# Altium project CC2640R2F_Bluetooth_Beacon.PrjPCB
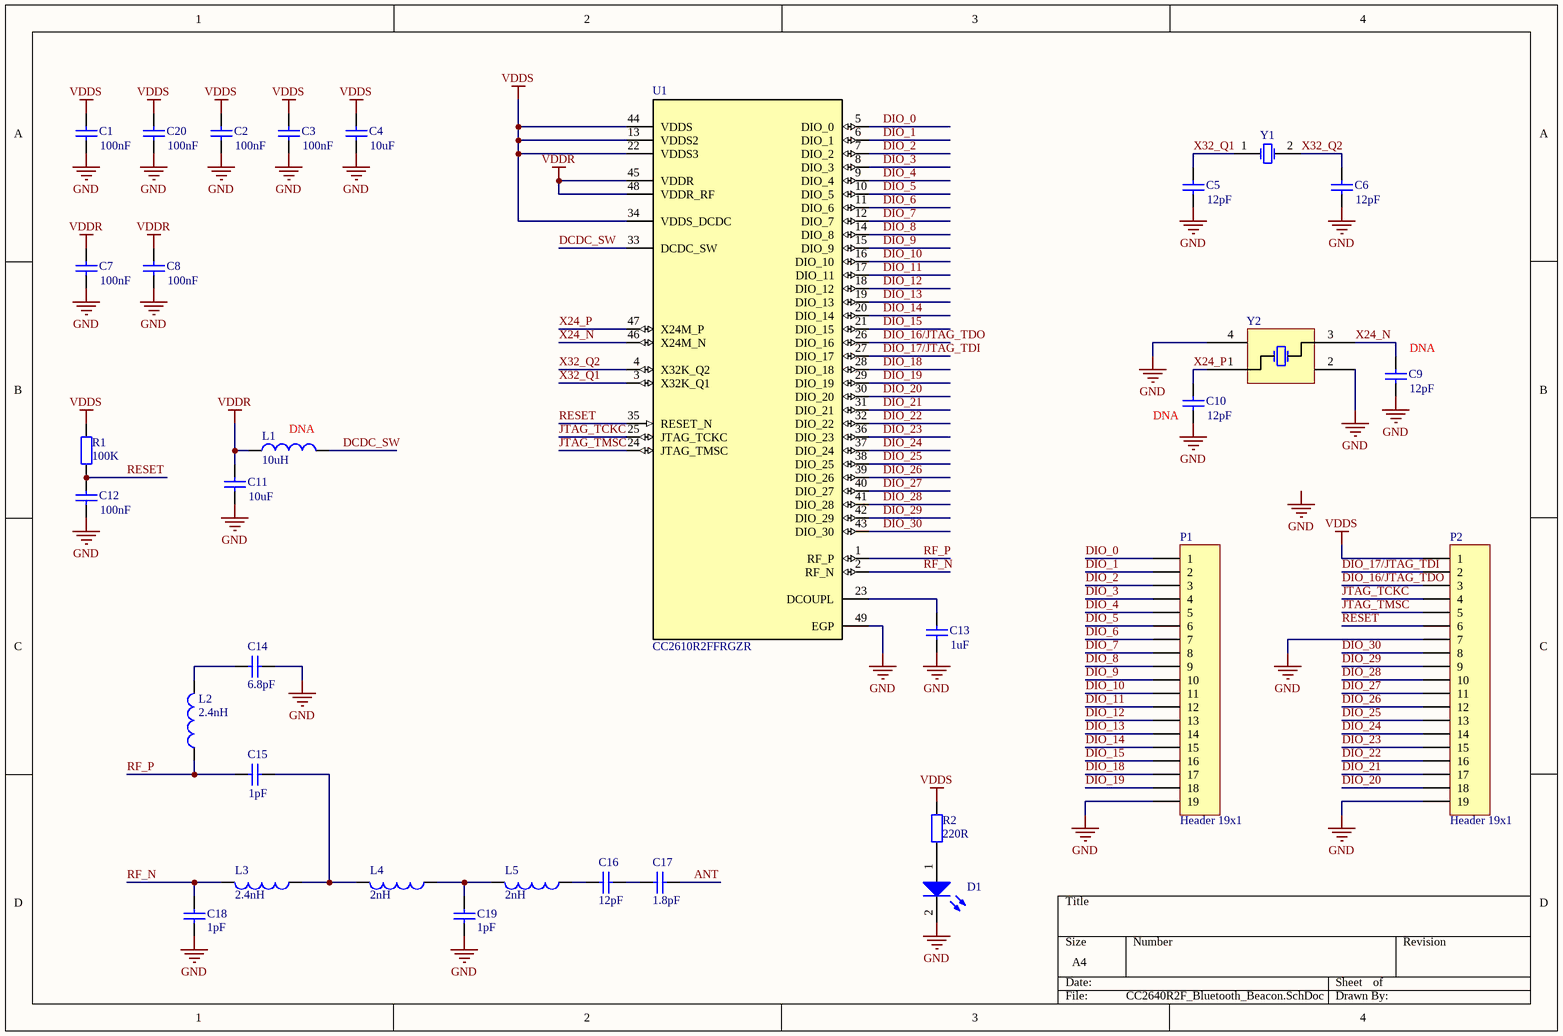
[diagram p0: CC2640R2F_Bluetooth_Beacon.SchDoc]
1 sheet, 33 parts. Net scope: global (net labels, ports and power ports of the same name join across sheets).
Board file: CC2640R2F_Bluetooth_Beacon.PcbDoc

## Sheet CC2640R2F_Bluetooth_Beacon.SchDoc
size A4

### Parts
C1  value 100nF  [0603]  (hidden comment: Cap)
C2  value 100nF  [0603]  (hidden comment: Cap)
C3  value 100nF  [0603]  (hidden comment: Cap)
C4  value 10uF  [0603]  (hidden comment: Cap)
C5  value 12pF  [0603]  (hidden comment: Cap)
C6  value 12pF  [0603]  (hidden comment: Cap)
C7  value 100nF  [0603]  (hidden comment: Cap)
C8  value 100nF  [0603]  (hidden comment: Cap)
C9  DNA  value 12pF  [0603]
C10  DNA  value 12pF  [0603]
C11  value 10uF  [0603]  (hidden comment: Cap)
C12  value 100nF  [0603]  (hidden comment: Cap)
C13  value 1uF  [0603]  (hidden comment: Cap)
C14  value 6.8pF  [0603]  (hidden comment: Cap)
C15  value 1pF  [0603]  (hidden comment: Cap)
C16  value 12pF  [0603]  (hidden comment: Cap)
C17  value 1.8pF  [0603]  (hidden comment: Cap)
C18  value 1pF  [0603]  (hidden comment: Cap)
C19  value 1pF  [0603]  (hidden comment: Cap)
C20  value 100nF  [0603]  (hidden comment: Cap)
D1  LED  [0603]  (value not drawn)
L1  DNA  value 10uH  [0603]
L2  value 2.4nH  [0603]  (hidden comment: Inductor)
L3  value 2.4nH  [0603]  (hidden comment: Inductor)
L4  value 2nH  [0603]  (hidden comment: Inductor)
L5  value 2nH  [0603]  (hidden comment: Inductor)
P1  Header 19x1  [HDR1X19]
P2  Header 19x1  [HDR1X19]
R1  value 100K  [0603]  (hidden comment: Res)
R2  value 220R  [0603]  (hidden comment: Res)
U1  CC2610R2FFRGZR  [VQFN-48]
Y1  XTAL  [FC-135]  (value not drawn)
Y2  XTAL-2  [TX-3225]  (value not drawn)

### Nets
GND: C1.1 C2.1 C3.1 C4.1 C5.1 C6.1 C7.1 C8.1 C9.1 C10.1 C11.1 C12.1 C13.1 C14.1 C18.1 C19.1 C20.1 D1.2(K) P1.19 P2.7 P2.19 U1.49(EGP) Y2.2 Y2.4
VDDR: C7.2 C8.2 C11.2 L1.1 U1.45(VDDR) U1.48(VDDR_RF)
VDDS: C1.2 C2.2 C3.2 C4.2 C20.2 P2.1 R1.2 R2.2 U1.13(VDDS2) U1.22(VDDS3) U1.34(VDDS_DCDC) U1.44(VDDS)
ANT: C17.1
DCDC_SW: L1.2 U1.33(DCDC_SW)
DIO_0: P1.1 U1.5(DIO_0)
DIO_1: P1.2 U1.6(DIO_1)
DIO_2: P1.3 U1.7(DIO_2)
DIO_3: P1.4 U1.8(DIO_3)
DIO_4: P1.5 U1.9(DIO_4)
DIO_5: P1.6 U1.10(DIO_5)
DIO_6: P1.7 U1.11(DIO_6)
DIO_7: P1.8 U1.12(DIO_7)
DIO_8: P1.9 U1.14(DIO_8)
DIO_9: P1.10 U1.15(DIO_9)
DIO_10: P1.11 U1.16(DIO_10)
DIO_11: P1.12 U1.17(DIO_11)
DIO_12: P1.13 U1.18(DIO_12)
DIO_13: P1.14 U1.19(DIO_13)
DIO_14: P1.15 U1.20(DIO_14)
DIO_15: P1.16 U1.21(DIO_15)
DIO_16/JTAG_TDO: P2.3 U1.26(DIO_16)
DIO_17/JTAG_TDI: P2.2 U1.27(DIO_17)
DIO_18: P1.17 U1.28(DIO_18)
DIO_19: P1.18 U1.29(DIO_19)
DIO_20: P2.18 U1.30(DIO_20)
DIO_21: P2.17 U1.31(DIO_21)
DIO_22: P2.16 U1.32(DIO_22)
DIO_23: P2.15 U1.36(DIO_23)
DIO_24: P2.14 U1.37(DIO_24)
DIO_25: P2.13 U1.38(DIO_25)
DIO_26: P2.12 U1.39(DIO_26)
DIO_27: P2.11 U1.40(DIO_27)
DIO_28: P2.10 U1.41(DIO_28)
DIO_29: P2.9 U1.42(DIO_29)
DIO_30: P2.8 U1.43(DIO_30)
JTAG_TCKC: P2.4 U1.25(JTAG_TCKC)
JTAG_TMSC: P2.5 U1.24(JTAG_TMSC)
RESET: C12.2 P2.6 R1.1 U1.35(RESET_N)
RF_N: C18.2 L3.2 U1.2(RF_N)
RF_P: C15.2 L2.1 U1.1(RF_P)
X24_N: C9.2 U1.46(X24M_N) Y2.3
X24_P: C10.2 U1.47(X24M_P) Y2.1
X32_Q1: C5.2 U1.3(X32K_Q1) Y1.1(OSC1)
X32_Q2: C6.2 U1.4(X32K_Q2) Y1.2(OSC2)
NetC13_2: C13.2 U1.23(DCOUPL)
NetC14_2: C14.2 L2.2
NetC15_1: C15.1 L3.1 L4.2
NetC16_1: C16.1 C17.2
NetC16_2: C16.2 L5.1
NetC19_2: C19.2 L4.1 L5.2
NetD1_1: D1.1(A) R2.1

### Notes on the sheet
- Labels drawn without touching a wire or pin: GND

### Library data of the parts
C1-C3 C7 C8 C12 C20 = Cap: Capacitor; MPN: 885012206071; Manufacturer: Wurth Electronics; Supplier Link: https://www.mouser.com/ProductDetail/Wurth-Electronics/885012206071?qs=sGAEpiMZZMs0AnBnWHyRQEGbLOF2VP1iprT3n4FXsKyn%252b5OoMJVgRQ%3d%3d; Supplier Part Number: 710-885012206071
C4 C11 = Cap: Capacitor; MPN: JMK107BJ106MA-T; Manufacturer: Taiyo Yuden; Supplier Link: https://www.mouser.com/ProductDetail/Taiyo-Yuden/JMK107BJ106MA-T?qs=sGAEpiMZZMs0AnBnWHyRQAEIN6r3SS%2fOEP5qaUMlPNg%3d; Supplier Part Number: 963-JMK107BJ106MA-T
C5 C6 C9 C10 C16 = Cap: Capacitor; MPN: VJ0603A120KXJPW1BC; Manufacturer: Vishay / Vitramon; Supplier Link: https://www.mouser.com/ProductDetail/Vishay-Vitramon/VJ0603A120KXJPW1BC?qs=sGAEpiMZZMs0AnBnWHyRQKsgPTXVq8S7t2i4iQyzRpM%3d; Supplier Part Number: 77-VJ0603A120KXJPBC
C13 = Cap: Capacitor; MPN: 885012106022; Manufacturer: Wurth Electronics; Supplier Link: https://www.mouser.com/ProductDetail/Wurth-Electronics/885012106022?qs=sGAEpiMZZMs0AnBnWHyRQEGbLOF2VP1issYJf5wWNqidR49W7Sdttw%3d%3d; Supplier Part Number: 710-885012106022
C14 = Cap: Capacitor; MPN: 885012006031; Manufacturer: Wurth Electronics; Supplier Link: https://www.mouser.com/ProductDetail/Wurth-Electronics/885012006031?qs=sGAEpiMZZMs0AnBnWHyRQEGbLOF2VP1iRUQIH%252bqDJv3PNqW0AZpQIA%3d%3d; Supplier Part Number: 710-885012006031
C15 C18 C19 = Cap: Capacitor; MPN: 885012006087; Manufacturer: Wurth Electronics; Supplier Link: https://www.mouser.com/ProductDetail/Wurth-Electronics/885012006087?qs=sGAEpiMZZMs0AnBnWHyRQN7%2fAA2D2lPPR46O60s6EtSqQssKVrCP5Q%3d%3d; Supplier Part Number: 710-885012006087
C17 = Cap: Capacitor; MPN: CC0603CRNPO9BN1R8; Manufacturer: Yageo; Supplier Link: https://www.mouser.com/ProductDetail/Yageo/CC0603CRNPO9BN1R8?qs=sGAEpiMZZMs0AnBnWHyRQDvo%2fxRt9F0%2fHU8%252bHqHr2sQ%3d; Supplier Part Number: 603-CC603CRNPO9BN1R8
D1 = LED: Typical RED GaAs LED; MPN: 150060GS75000; Manufacturer: Wurth Electronics; Supplier Link: https://www.mouser.com/ProductDetail/Wurth-Electronics/150060GS75000?qs=sGAEpiMZZMseGfSY3csMkQ6oANueNQcIKT4iGgSHkGN63EsSMr%252bd5g%3d%3d; Supplier Part Number: 710-150060GS75000
L1 = Inductor: MPN: MLZ1608E100MT
L2 L3 = Inductor: MPN: LQW18AN2N4C80D; Manufacturer: Murata Electronics; Supplier Link: https://www.mouser.com/ProductDetail/Murata-Electronics/LQW18AN2N4C80D?qs=coxMWmu44UCdz9qQr10jVQ%3d%3d; Supplier Part Number: 81-LQW18AN2N4C80D
L4 L5 = Inductor: MPN: LQG15HZ2N0S02D; Manufacturer: Murata Electronics; Supplier Link: https://www.mouser.com/ProductDetail/Murata-Electronics/LQG15HZ2N0S02D?qs=sGAEpiMZZMsg%252by3WlYCkU2iuTbKTbm6Zkdsgk8LnMOk%3d; Supplier Part Number: 81-LQG15HZ2N0S02D
P1 P2 = Header 19x1: Header, 19-Pin
R1 = Res: Resistor; MPN: ESR03EZPJ104; Manufacturer: ROHM Semiconductor; Supplier Link: https://www.mouser.com/ProductDetail/ROHM-Semiconductor/ESR03EZPJ104?qs=sGAEpiMZZMu61qfTUdNhG79AcIiSWYOgR45ebb3hKTsTJw32sWIHcw%3d%3d; Supplier Part Number: 755-ESR03EZPJ104
R2 = Res: Resistor; MPN: ESR03EZPJ221; Manufacturer: ROHM Semiconductor; Supplier Link: https://www.mouser.com/ProductDetail/ROHM-Semiconductor/ESR03EZPJ221?qs=sGAEpiMZZMu61qfTUdNhG1IKPAnaLGejce8FZC1%2fFYU%3d; Supplier Part Number: 755-ESR03EZPJ221
U1 = CC2640R2FRGZR: CC2640R2F SimpleLink™ Bluetooth® low energy Wireless MCU; Manufacturer: Texas Instruments; MPN: CC2640R2FRGZR; Supplier Link: https://www.mouser.com/ProductDetail/Texas-Instruments/CC2640R2FRGZR?qs=sGAEpiMZZMuuc7S3exxspmq9hSZUH82RKnwvYmvdTCjVb6OIHMWFXw%3d%3d; Supplier Part Number: 595-CC2640R2FRGZR
Y1 = XTAL: Crystal Oscillator; MPN: FC-135 32.7680KA-AG3; Manufacturer: Epson Timing; Supplier Link: https://www.mouser.com/ProductDetail/Epson-Timing/FC-135-327680KA-AG3?qs=sGAEpiMZZMsBj6bBr9Q9aZLqXgWtLYAXjglhGIUwX4I%3d; Supplier Part Number: 732-FC135-32.76KAAG3
Y2 = XTAL-2: Crystal Oscillator; MPN: TSX-3225 24.0000MF15X-AC3; Manufacturer: Epson Timing; Supplier Link: https://www.mouser.com/ProductDetail/Epson-Timing/TSX-3225-240000MF15X-AC3?qs=sGAEpiMZZMsBj6bBr9Q9acukpafrIaZ11siWonQt25M%3d; Supplier Part Number: 732-TX325-24F15X-AC3